# EAGLE schematic 8884bt Remote Control Receiver (EAGLE 6.5.0)
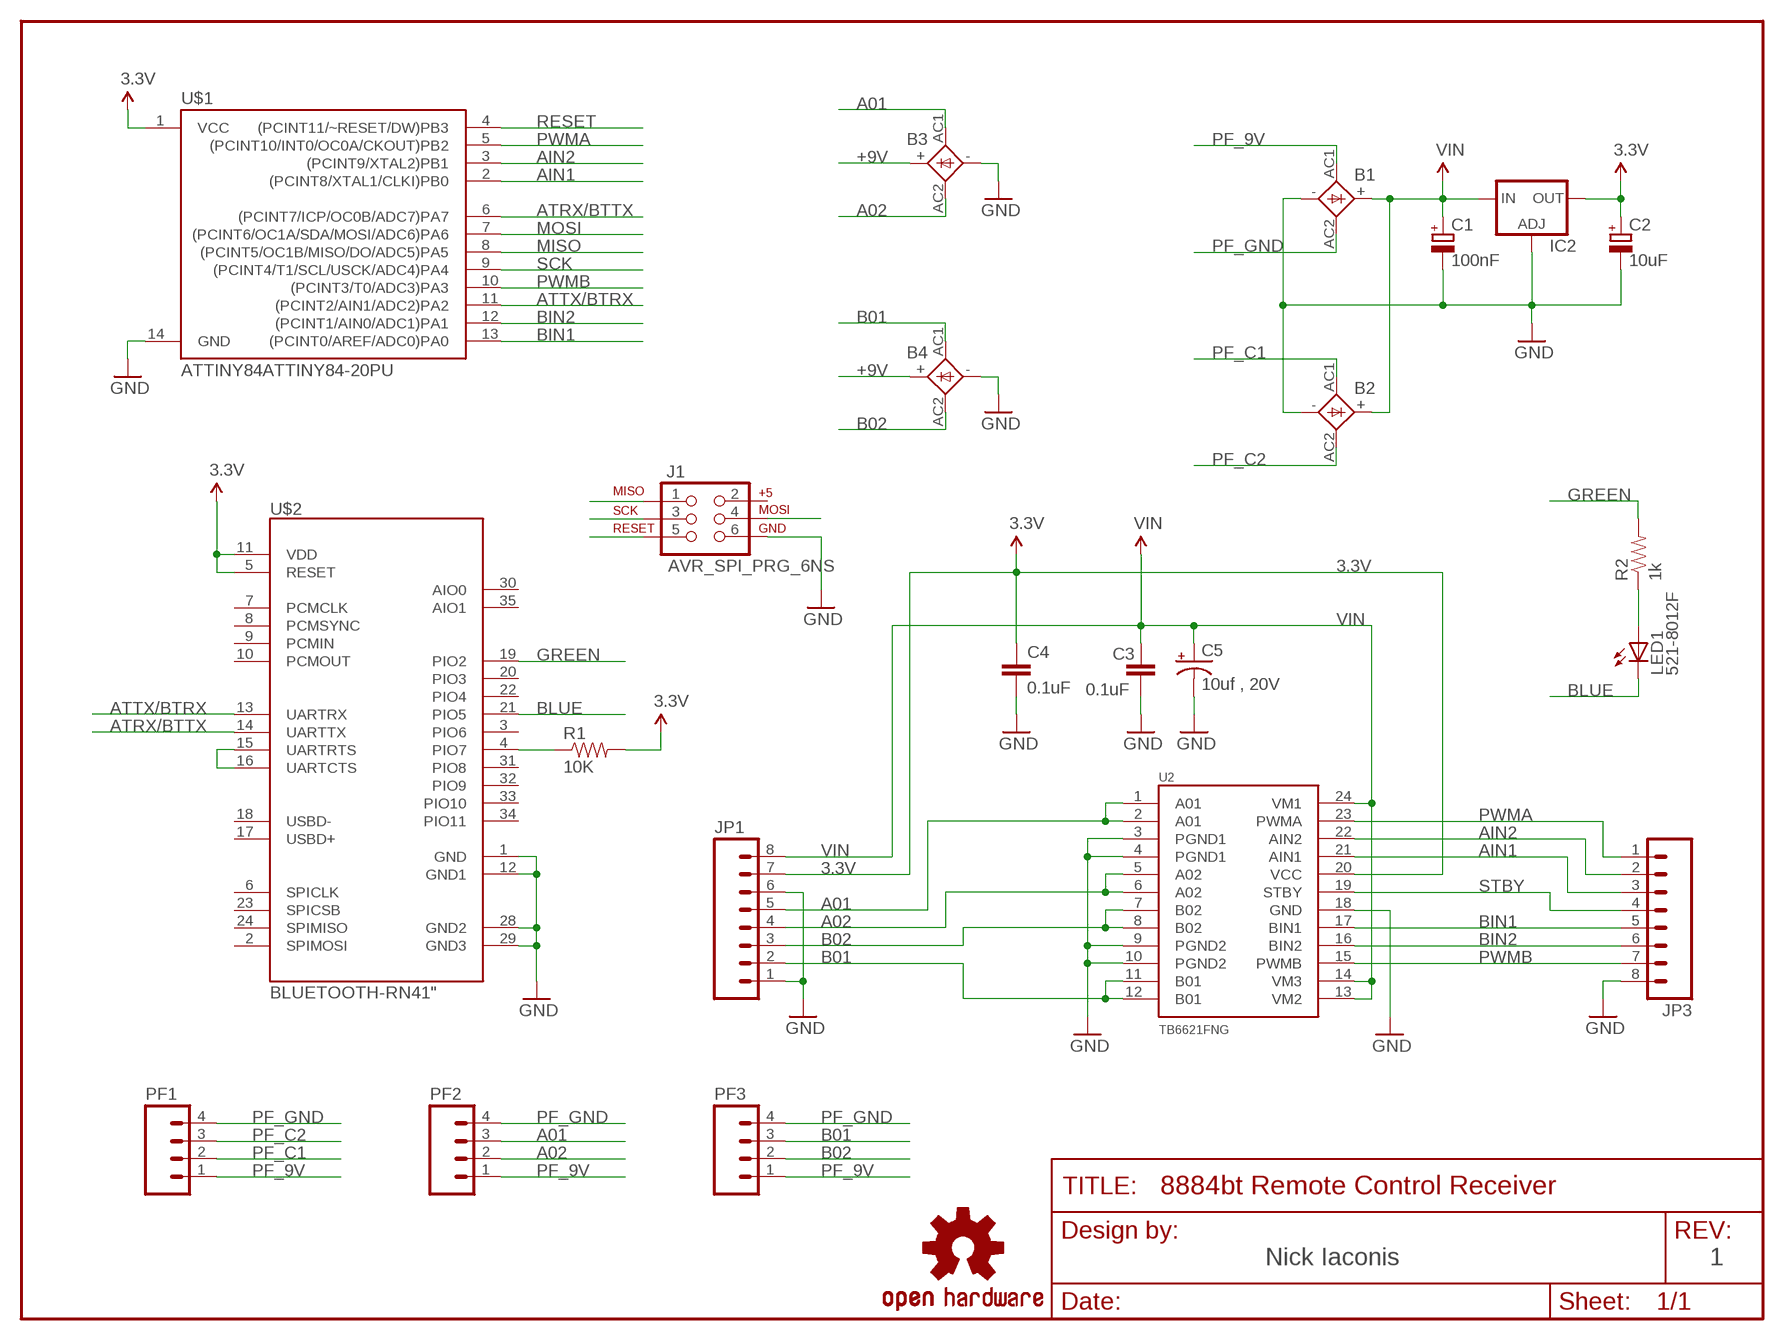
[diagram p0: schematic, sheet 1]

## Parts
B1  2KBB-R  [2KBB-R]
B2  2KBB-R  [2KBB-R]
B3  2KBB-R  [2KBB-R]
B4  2KBB-R  [2KBB-R]
C1  100nF  CPOL-EUE10-20  [EB20D]
C2  10uF  CPOL-EUE10-20  [EB20D]
C3  0.1uF  CAP0402-CAP  [0402-CAP]
C4  0.1uF  CAP0402-CAP  [0402-CAP]
C5  10uf , 20V  CAP_POL3528  [EIA3528]
IC2  LM317TS  [317TS]
J1  AVR_SPI_PRG_6NS  [2X3-NS]
JP1  M08LONGPADS  [1X08_LONGPADS]
JP3  M08LONGPADS  [1X08_LONGPADS]
LED1  521-8012F  LED3MM  [LED3MM]
LOGO1  OSHW-LOGOM  [OSHW-LOGO-M]
PF1  M04PTH  [1X04]
PF2  M04PTH  [1X04]
PF3  M04PTH  [1X04]
R1  10K  10KOHM1/10W1%(0603)0603  [0603-RES]
R2  1k  RESISTOR0805-RES  [0805]
U2  TB6621FNG  [SSOP24]
U$1  ATTINY84ATTINY84-20PU  [DIL14]
U$2  BLUETOOTH-RN41"  [RN41]

## Nets
3.3V: C2.+ C4.1 IC2.2(OUT) JP1.7 R1.2 U2.20(VCC) U$1.1(VCC) U$2.5(RESET) U$2.11(VDD)
+9V: B3.+ B4.+
A01: B3.AC1 JP1.5 PF2.3 U2.1(A01) U2.2(A01)
A02: B3.AC2 JP1.4 PF2.2 U2.5(A02) U2.6(A02)
AIN1: JP3.3 U2.21(AIN1) U$1.2((PCINT8/XTAL1/CLKI)PB0)
AIN2: JP3.2 U2.22(AIN2) U$1.3((PCINT9/XTAL2)PB1)
ATRX/BTTX: U$1.6((PCINT7/ICP/OC0B/ADC7)PA7) U$2.14(UARTTX)
ATTX/BTRX: U$1.11((PCINT2/AIN1/ADC2)PA2) U$2.13(UARTRX)
B01: B4.AC1 JP1.2 PF3.3 U2.11(B01) U2.12(B01)
B02: B4.AC2 JP1.3 PF3.2 U2.7(B02) U2.8(B02)
BIN1: JP3.5 U2.17(BIN1) U$1.13((PCINT0/AREF/ADC0)PA0)
BIN2: JP3.6 U2.16(BIN2) U$1.12((PCINT1/AIN0/ADC1)PA1)
BLUE: LED1.K(C) U$2.21(PIO5)
GND: B1.- B2.- B3.- B4.- C1.- C2.- C3.2 C4.2 C5.C(-) IC2.1(ADJ) J1.6 JP1.1 JP1.6 JP3.8 U2.3(PGND1) U2.4(PGND1) U2.9(PGND2) U2.10(PGND2) U2.18(GND) U$1.14(GND) U$2.1(GND) U$2.12(GND1) U$2.28(GND2) U$2.29(GND3)
GREEN: R2.2 U$2.19(PIO2)
MISO: J1.1 U$1.8((PCINT5/OC1B/MISO/DO/ADC5)PA5)
MOSI: J1.4 U$1.7((PCINT6/OC1A/SDA/MOSI/ADC6)PA6)
N$7: U$2.15(UARTRTS) U$2.16(UARTCTS)
N$15: R1.1 U$2.4(PIO7)
N$16: LED1.A R2.1
PF_9V: B1.AC1 PF1.1 PF2.1 PF3.1
PF_C1: B2.AC1 PF1.2
PF_C2: B2.AC2 PF1.3
PF_GND: B1.AC2 PF1.4 PF2.4 PF3.4
PWMA: JP3.1 U2.23(PWMA) U$1.5((PCINT10/INT0/OC0A/CKOUT)PB2)
PWMB: JP3.7 U2.15(PWMB) U$1.10((PCINT3/T0/ADC3)PA3)
RESET: J1.5 U$1.4((PCINT11/~RESET/DW)PB3)
SCK: J1.3 U$1.9((PCINT4/T1/SCL/USCK/ADC4)PA4)
STBY: JP3.4 U2.19(STBY)
VIN: B1.+ B2.+ C1.+ C3.1 C5.A(+) IC2.3(IN) JP1.8 U2.13(VM2) U2.14(VM3) U2.24(VM1)
Unconnected: J1.2 U$2.2(SPIMOSI) U$2.3(PIO6) U$2.6(SPICLK) U$2.7(PCMCLK) U$2.8(PCMSYNC) U$2.9(PCMIN) U$2.10(PCMOUT) U$2.17(USBD+) U$2.18(USBD-) U$2.20(PIO3) U$2.22(PIO4) U$2.23(SPICSB) U$2.24(SPIMISO) U$2.30(AIO0) U$2.31(PIO8) U$2.32(PIO9) U$2.33(PIO10) U$2.34(PIO11) U$2.35(AIO1)

## Notes on the sheet
- Nick Iaconis | 1

## Library data of the parts
B1-B4 = rectifier:2KBB-R: RECTIFIER grid 3 x 5 mm
C1 C2 = rcl:CPOL-EU: POLARIZED CAPACITOR, European symbol
C3 C4 = SparkFun:CAP: Capacitor Standard 0603 ceramic capacitor, and 0.1" leaded capacitor.
C5 = SparkFun:CAP_POL: Capacitor Polarized These are standard SMD and PTH capacitors. Normally 10uF, 47uF, and 100uF in electrolytic and tantalum varieties. Always verify the external diameter of the through hole cap, it varies with capacity, voltage, and manufacturer. The EIA devices should be standard.
IC2 = v-reg:LM317TS: VOLTAGE REGULATOR
J1 = SparkFun-Connectors:AVR_SPI_PRG_6: AVR ISP 6 Pin This is the reduced ISP connector for AVR programming. Common on Arduino. This footprint will take up less PCB space and can be used with a 10-pin to 6-pin adapter such as SKU: BOB-08508
JP1 JP3 = SparkFun:M08: Header 8 Standard 8-pin 0.1" header. Use with straight break away headers (SKU : PRT-00116), right angle break away headers (PRT-00553), swiss pins (PRT-00743), machine pins (PRT-00117), and female headers (PRT-00115).
LED1 = led:LED: LED OSRAM: - CHIPLED LG R971, LG N971, LY N971, LG Q971, LY Q971, LO R971, LY R971 LH N974, LH R974 LS Q976, LO Q976, LY Q976 LO Q996 - Hyper CHIPLED LW Q18S LB Q993, LB Q99A, LB R99A - SideLED LS A670, LO A670, LY A670, LG A670, LP A670 LB A673, LV A673, LT A673, LW A673 LH A674 LY A675 LS A676, LA A676, LO A676, LY A676, LW A676 LS A679, LY A679, LG A679 - Hyper Micro SIDELED® LS Y876, LA Y876, LO Y876, LY Y876 LT Y87S - SmartLED LW L88C, LW L88S LB L89C, LB L89S, LG L890 LS L89K, LO L89K, LY L89K LS L896, LA L896, LO L896, LY L896 - TOPLED LS T670, LO T670, LY T670, LG T670, LP T670 LSG T670, LSP T670, LSY T670, LOP T670, LYG T670 LG T671, LOG T671, LSG T671 LB T673, LV T673, LT T673, LW T673 LH T674 LS T676, LA T676, LO T676, LY T676, LB T676, LH T676, LSB T676, LW T676 LB T67C, LV T67C, LT T67C, LS T67K, LO T67K, LY T67K, LW E67C LS E67B, LA E67B, LO E67B, LY E67B, LB E67C, LV E67C, LT E67C LW T67C LS T679, LY T679, LG T679 LS T770, LO T770, LY T770, LG T770, LP T770 LB T773, LV T773, LT T773, LW T773 LH T774 LS E675, LA E675, LY E675, LS T675 LS T776, LA T776, LO T776, LY T776, LB T776 LHGB T686 LT T68C, LB T68C - Hyper Mini TOPLED® LB M676 - Mini TOPLED Santana® LG M470 LS M47K, LO M47K, LY M47K Source: http://www.osram.convergy.de LUXEON: - LUMILED® LXK2-PW12-R00, LXK2-PW12-S00, LXK2-PW14-U00, LXK2-PW14-V00 LXK2-PM12-R00, LXK2-PM12-S00, LXK2-PM14-U00 LXK2-PE12-Q00, LXK2-PE12-R00, LXK2-PE12-S00, LXK2-PE14-T00, LXK2-PE14-U00 LXK2-PB12-K00, LXK2-PB12-L00, LXK2-PB12-M00, LXK2-PB14-N00, LXK2-PB14-P00, LXK2-PB14-Q00 LXK2-PR12-L00, LXK2-PR12-M00, LXK2-PR14-Q00, LXK2-PR14-R00 LXK2-PD12-Q00, LXK2-PD12-R00, LXK2-PD12-S00 LXK2-PH12-R00, LXK2-PH12-S00 LXK2-PL12-P00, LXK2-PL12-Q00, LXK2-PL12-R00 Source: www.luxeon.com KINGBRIGHT: KA-3528ASYC Source: www.kingbright.com
LOGO1 = SparkFun-Aesthetics:OSHW-LOGO: Open Source Hardware Logo This logo indicates the piece of hardware it is found on incorporates a OSHW license and/or adheres to the definition of open source hardware found here: http://freedomdefined.org/OSHW
PF1-PF3 = SparkFun-Connectors:M04: Header 4 Standard 4-pin 0.1" header. Use with straight break away headers (SKU : PRT-00116), right angle break away headers (PRT-00553), swiss pins (PRT-00743), machine pins (PRT-00117), and female headers (PRT-00115). Molex polarized connector foot print use with SKU : PRT-08231 with associated crimp pins and housings. 1MM SMD Version SKU: PRT-10208
R1 = SparkFun-Resistors:10KOHM1/10W1%(0603): RES-00824; PROD_ID: RES-00824
R2 = SparkFun-Resistors:RESISTOR: Resistor Basic schematic elements and footprints for 0603, 1206, and PTH resistors.
U2 = SparkFun:TB6621FNG: Toshiba 1A motor driver
U$1 = SparkFun-DigitalIC:ATTINY84: Atmel 14-pin 2/4/8kB flash uC
U$2 = SparkFun-RF:BLUETOOTH-RN41: Bluetooth SMD module